# Altium schematic sheet Robo.SchDoc
size A; SheetNumber: 1; SheetTotal: 2
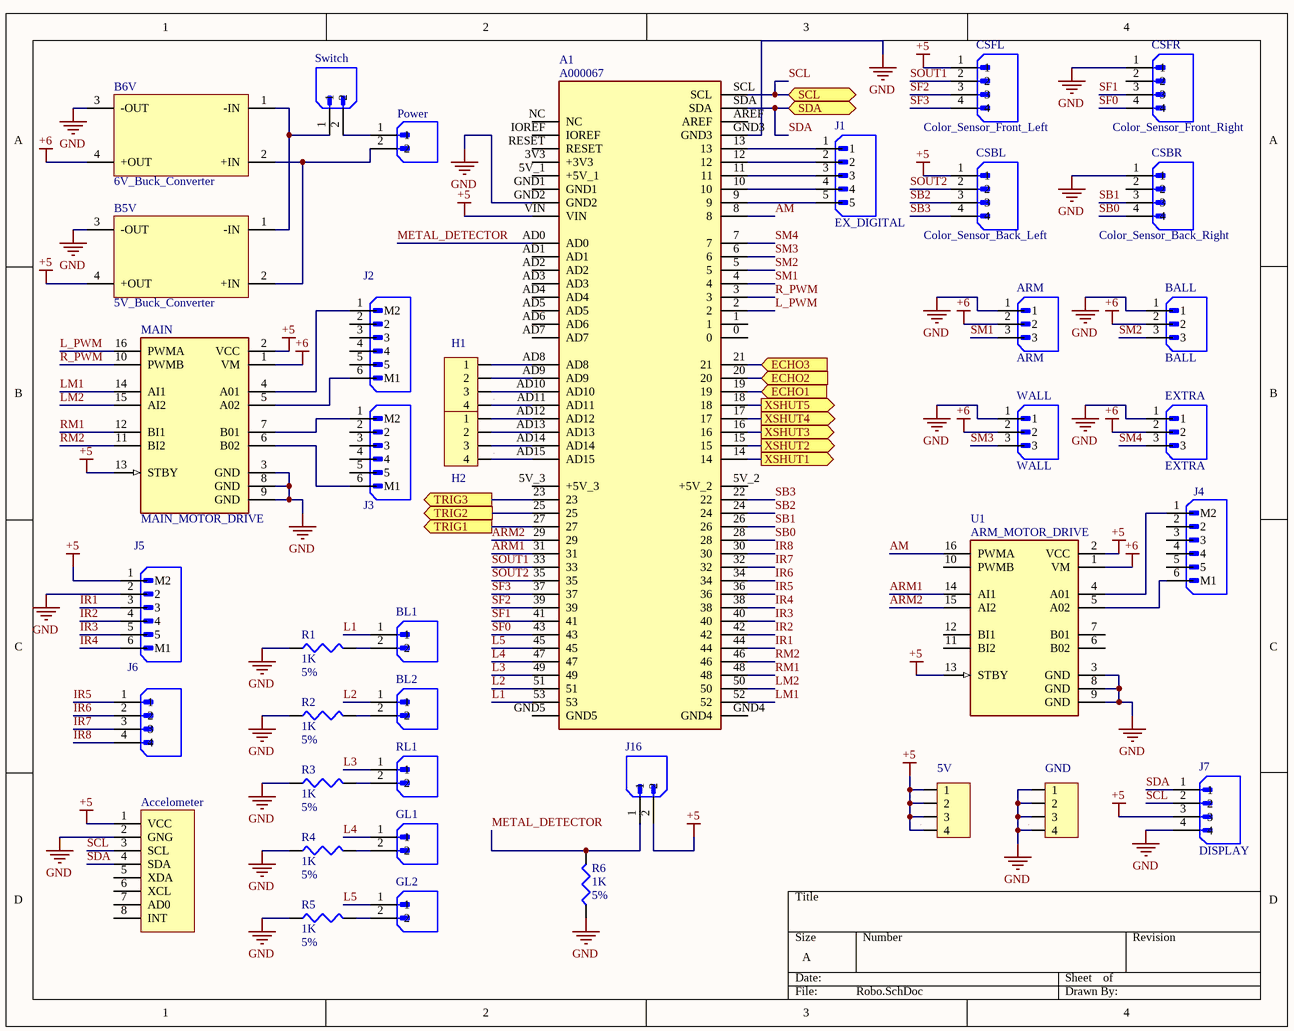
[diagram p0: Robo.SchDoc]

## Parts
5V  61300411121  [61300411121 - duplicate - duplicate]  (value not drawn)
A1  A000067  [ARDUINO_A000067]
Accelometer  Accelometer  [8pin_header]  (value not drawn)
ARM  ARM  [JST_B3B-XH-A (LF)(SN)]
B5V  5V_Buck_Converter  [Buck_Conveter]
B6V  6V_Buck_Converter  [Buck_Conveter]
BALL  BALL  [JST_B3B-XH-A (LF)(SN)]
BL1  B2B-XH-A(LF)(SN)  [JST_B2B-XH-A(LF)(SN)]  (value not drawn)
BL2  B2B-XH-A(LF)(SN)  [JST_B2B-XH-A(LF)(SN)]  (value not drawn)
CSBL  Color_Sensor_Back_Left  [JST_B4B-XH-A(LF)(SN)]
CSBR  Color_Sensor_Back_Right  [JST_B4B-XH-A(LF)(SN)]
CSFL  Color_Sensor_Front_Left  [JST_B4B-XH-A(LF)(SN)]
CSFR  Color_Sensor_Front_Right  [JST_B4B-XH-A(LF)(SN)]
EXTRA  EXTRA  [JST_B3B-XH-A (LF)(SN)]
GL1  B2B-XH-A(LF)(SN)  [JST_B2B-XH-A(LF)(SN)]  (value not drawn)
GL2  B2B-XH-A(LF)(SN)  [JST_B2B-XH-A(LF)(SN)]  (value not drawn)
GND  61300411121  [61300411121 - duplicate - duplicate]  (value not drawn)
H1  61300411121  [61300411121 - duplicate - duplicate]  (value not drawn)
H2  61300411121  [61300411121 - duplicate - duplicate]  (value not drawn)
J1  EX_DIGITAL  [JST_B5B-XH-A(LF)(SN)]
J2  B6B-XH-A(LF)(SN)  [JST_B6B-XH-A(LF)(SN)]  (value not drawn)
J3  B6B-XH-A(LF)(SN)  [JST_B6B-XH-A(LF)(SN)]  (value not drawn)
J4  B6B-XH-A(LF)(SN)  [JST_B6B-XH-A(LF)(SN)]  (value not drawn)
J5  B6B-XH-A(LF)(SN)  [JST_B6B-XH-A(LF)(SN)]  (value not drawn)
J6  B4B-XH-A(LF)(SN)  [JST_B4B-XH-A(LF)(SN)]  (value not drawn)
J7  DISPLAY  [JST_B4B-XH-A(LF)(SN)]
J16  B2B-XH-A(LF)(SN)  [JST_B2B-XH-A(LF)(SN)]  (value not drawn)
MAIN  MAIN_MOTOR_DRIVE  [MODULE_ROB-14450]
Power  B2B-XH-A(LF)(SN)  [JST_B2B-XH-A(LF)(SN)]  (value not drawn)
R1  Resistance: 1K  Tolerance: 5%  [Resister]  (hidden comment: CFM12JT1K00)
R2  Resistance: 1K  Tolerance: 5%  [Resister]  (hidden comment: CFM12JT1K00)
R3  Resistance: 1K  Tolerance: 5%  [Resister]  (hidden comment: CFM12JT1K00)
R4  Resistance: 1K  Tolerance: 5%  [Resister]  (hidden comment: CFM12JT1K00)
R5  Resistance: 1K  Tolerance: 5%  [Resister]  (hidden comment: CFM12JT1K00)
R6  Resistance: 1K  Tolerance: 5%  [Resister]  (hidden comment: CFM12JT1K00)
RL1  B2B-XH-A(LF)(SN)  [JST_B2B-XH-A(LF)(SN)]  (value not drawn)
Switch  B2B-XH-A(LF)(SN)  [JST_B2B-XH-A(LF)(SN)]  (value not drawn)
U1  ARM_MOTOR_DRIVE  [MODULE_ROB-14450]
WALL  WALL  [JST_B3B-XH-A (LF)(SN)]

## Ports
ECHO1 (in, see Robo2[3A]), ECHO2 (in, see Robo2[3A]), ECHO3 (in, see Robo2[1B]), SCL (bidir, see Robo2[1A], Robo2[1B], Robo2[2A], Robo2[2B], Robo2[3B]), SDA (bidir, see Robo2[1A], Robo2[1B], Robo2[2A], Robo2[2B], Robo2[3B]), TRIG1 (out, see Robo2[3A]), TRIG2 (out, see Robo2[3A]), TRIG3 (out, see Robo2[1A]), XSHUT1 (out, see Robo2[1A]), XSHUT2 (out, see Robo2[2A]), XSHUT3 (out, see Robo2[2B]), XSHUT4 (out, see Robo2[2B]), XSHUT5 (out, see Robo2[1B])

## Nets
+5: 5V.1 5V.2 5V.3 5V.4 A1.VIN Accelometer.1(VCC) B5V.4(+OUT) CSBL.1 CSFL.1 J5.1(M2) J7.3 J16.2 MAIN.2(VCC) MAIN.13(STBY) U1.2(VCC) U1.13(STBY)
+6: ARM.2 B6V.4(+OUT) BALL.2 EXTRA.2 MAIN.1(VM) U1.1(VM) WALL.2
GND: A1.GND2 A1.GND3 Accelometer.2(GNG) ARM.1 B5V.3(-OUT) B6V.3(-OUT) BALL.1 CSBR.1 CSFR.1 EXTRA.1 GND.1 GND.2 GND.3 GND.4 J5.2 J7.4 MAIN.3(GND) MAIN.8(GND) MAIN.9(GND) R1.1 R2.1 R3.1 R4.1 R5.1 R6.1 U1.3(GND) U1.8(GND) U1.9(GND) WALL.1
AM: A1.8 U1.16(PWMA)
ARM1: A1.31 U1.14(AI1)
ARM2: A1.29 U1.15(AI2)
ECHO1: A1.19 ; port ECHO1
ECHO2: A1.20 ; port ECHO2
ECHO3: A1.21 ; port ECHO3
IR1: A1.44 J5.3
IR2: A1.42 J5.4
IR3: A1.40 J5.5
IR4: A1.38 J5.6(M1)
IR5: A1.36 J6.1
IR6: A1.34 J6.2
IR7: A1.32 J6.3
IR8: A1.30 J6.4
L1: A1.53 BL1.1
L2: A1.51 BL2.1
L3: A1.49 RL1.1
L4: A1.47 GL1.1
L5: A1.45 GL2.1
L_PWM: A1.2 MAIN.16(PWMA)
LM1: A1.52 MAIN.14(AI1)
LM2: A1.50 MAIN.15(AI2)
METAL_DETECTOR: A1.AD0 J16.1 R6.2
R_PWM: A1.3 MAIN.10(PWMB)
RM1: A1.48 MAIN.12(BI1)
RM2: A1.46 MAIN.11(BI2)
SB0: A1.28 CSBR.4
SB1: A1.26 CSBR.3
SB2: A1.24 CSBL.3
SB3: A1.22 CSBL.4
SCL: A1.SCL Accelometer.3(SCL) J7.2 ; port SCL
SDA: A1.SDA Accelometer.4(SDA) J7.1 ; port SDA
SF0: A1.43 CSFR.4
SF1: A1.41 CSFR.3
SF2: A1.39 CSFL.3
SF3: A1.37 CSFL.4
SM1: A1.4 ARM.3
SM2: A1.5 BALL.3
SM3: A1.6 WALL.3
SM4: A1.7 EXTRA.3
SOUT1: A1.33 CSFL.2
SOUT2: A1.35 CSBL.2
TRIG1: A1.27 ; port TRIG1
TRIG2: A1.25 ; port TRIG2
TRIG3: A1.23 ; port TRIG3
XSHUT1: A1.14 ; port XSHUT1
XSHUT2: A1.15 ; port XSHUT2
XSHUT3: A1.16 ; port XSHUT3
XSHUT4: A1.17 ; port XSHUT4
XSHUT5: A1.18 ; port XSHUT5
NetA1_9: A1.9 J1.5
NetA1_10: A1.10 J1.4
NetA1_11: A1.11 J1.3
NetA1_12: A1.12 J1.2
NetA1_13: A1.13 J1.1
NetA1_AD8: A1.AD8 H1.1
NetA1_AD9: A1.AD9 H1.2
NetA1_AD10: A1.AD10 H1.3
NetA1_AD11: A1.AD11 H1.4
NetA1_AD12: A1.AD12 H2.1
NetA1_AD13: A1.AD13 H2.2
NetA1_AD14: A1.AD14 H2.3
NetA1_AD15: A1.AD15 H2.4
NetB5V_1: B5V.1(-IN) B6V.1(-IN) Switch.1
NetB5V_2: B5V.2(+IN) B6V.2(+IN) Power.2
NetBL1_2: BL1.2 R1.2
NetBL2_2: BL2.2 R2.2
NetGL1_2: GL1.2 R4.2
NetGL2_2: GL2.2 R5.2
NetJ2_1: J2.1(M2) MAIN.4(A01)
NetJ2_6: J2.6(M1) MAIN.5(A02)
NetJ3_1: J3.1(M2) MAIN.7(B01)
NetJ3_6: J3.6(M1) MAIN.6(B02)
NetJ4_1: J4.1(M2) U1.4(A01)
NetJ4_6: J4.6(M1) U1.5(A02)
NetPower_1: Power.1 Switch.2
NetR3_2: R3.2 RL1.2

Not connected (* = marked no-connect by the designer): A1 0 1 3V3(+3V3) 5V_1(+5V_1) 5V_2(+5V_2) 5V_3(+5V_3) AD1 AD2 AD3 AD4 AD5 AD6 AD7 AREF GND1 GND4 GND5 IOREF NC RESET; Accelometer 5(XDA) 6(XCL) 7(AD0) 8(INT); CSBR 2; CSFR 2; J2 2 3 4 5; J3 2 3 4 5; J4 2 3 4 5; U1 6(B02) 7(B01) 10(PWMB) 11(BI2) 12(BI1)

## Library data of the parts
5V GND H1 H2 = 61300411121: Board Connector, 4 Contact(s), 1 Row(s), Male, Straight, 0.1 inch Pitch, Solder Terminal, Locking, Black Insulator, Plug; Manufacturer: Wurth Electronics; Contact Pattern: RECTANGULAR; Contact Resistance: 20mR; Contact Style: SQ PIN-SKT; Dielectric Withstanding Voltage (AC): 500V; Insulation Resistance: 1GR; Number Of Connectors: 1; Rated Current (Signal): 3A; Number of Contacts: 4; Body Length: 0.4inch; Reference Standard: UL; Reliability: COMMERCIAL; Supplier: Digi-Key; Supplier Part Number: 732-5317-ND; Manufacturer Part Number: 61300411121; RoHS: Yes; Category: Headers and Wire Housings; Stock: 103058; Pricing: 1=0.19, 10=0.163, 25=0.1352, 50=0.113, 100=0.102, 1000=0.094 (USD); Mounting Technology: Board; Contact Material: Copper Alloy; Contact Finish - Mating: GOLD; Contact Finish - Termination: Gold (Au) - with Nickel (Ni) barrier; Insulation Color: Black; Insulation Material: Polybutylene; Min Operating Temperature: -40°C; Max Operating Temperature: 125°C; Connector Type: BOARD CONNECTOR; JESD-609 Code: e4; Body/Shell Style: PLUG; Contact Gender: Male; Mounting Style: STRAIGHT; Number of Rows Loaded: 1; PCB Contact Pattern: RECTANGULAR; Termination: Solder; Body Breadth: 0.1inch; Body Depth: 0.1inch; Mating Contact Pitch: 0.1inch; Mounting Option 1: LOCKING; Terminal Length: 0.118inch; Terminal Pitch: 2.54mm; Reach SVHC Compliant: Yes; RoHS Compliant: Yes; ComponentLink1URL: https://datasheet.ciiva.com:443/pdfs/VipMasterIC/IC/MIDC/MIDCS07676/MIDCS07676-1.pdf?src-supplier=IHS+Markit; ComponentLink1Description: https://datasheet.ciiva.com:443/pdfs/VipMasterIC/IC/MIDC/MIDCS07676/MIDCS07676-1.pdf?src-supplier=IHS+Markit; ComponentLink2URL: http://www.farnell.com/cad/1737268.pdf?src-supplier=Element14; ComponentLink2Description: http://www.farnell.com/cad/1737268.pdf?src-supplier=Element14; ComponentLink3URL: https://katalog.we-online.de/em/datasheet/6130xx11121.pdf?src-supplier=Digi-Key; ComponentLink3Description: https://katalog.we-online.de/em/datasheet/6130xx11121.pdf?src-supplier=Digi-Key
A1 = A000067: Arduino Mega 2560 Rev3. ATmega2560 Microcontroller Mega Development Board 16MHz CPU 8KB RAM 4KB/256KB EEPROM/Flash; MF: Arduino; Package: Non-Standard Arduino; Price: None; Check_prices: https://www.snapeda.com/parts/A000067/Arduino/view-part/?ref=eda; Value: *; SnapEDA_Link: https://www.snapeda.com/parts/A000067/Arduino/view-part/?ref=snap; MP: A000067; Availability: In Stock; Purchase-URL: https://pricing.snapeda.com/search?q=A000067&ref=eda
Accelometer = 8pin_headers
ARM BALL EXTRA WALL = B3B-XH-A_(LF)(SN): Connector Header Through Hole 3 position 0.098 (2.50mm); MF: JST Sales America Inc.; MP: B3B-XH-A (LF)(SN); SnapEDA_Link: https://www.snapeda.com/parts/B3B-XH-A%20(LF)(SN)/JST+Sales+America+Inc./view-part/?ref=snap; Package: None; Value: *; Check_prices: https://www.snapeda.com/parts/B3B-XH-A%20(LF)(SN)/JST+Sales+America+Inc./view-part/?ref=eda
B5V B6V = Buck_Converter
BL1 BL2 GL1 GL2 J16 Power RL1 Switch = B2B-XH-A(LF)(SN): Connector Header Through Hole 2 position 0.098 (2.50mm); MF: JST Sales America Inc.; SnapEDA_Link: https://www.snapeda.com/parts/B2B-XH-A(LF)(SN)/JST+Sales+America+Inc./view-part/?ref=snap; Package: None; Value: *; MP: B2B-XH-A(LF)(SN); Check_prices: https://www.snapeda.com/parts/B2B-XH-A(LF)(SN)/JST+Sales+America+Inc./view-part/?ref=eda
CSBL CSBR CSFL CSFR J6 J7 = B4B-XH-A(LF)(SN): Connector Header Through Hole 4 position 0.098 (2.50mm); MF: JST Sales; SnapEDA_Link: https://www.snapeda.com/parts/B4B-XH-A(LF)(SN)/JST+Sales+America+Inc./view-part/?ref=snap; Package: None; MP: B4B-XH-A(LF)(SN); Check_prices: https://www.snapeda.com/parts/B4B-XH-A(LF)(SN)/JST+Sales+America+Inc./view-part/?ref=eda; Purchase-URL: https://pricing.snapeda.com/search/part/B4B-XH-A(LF)(SN)/?ref=eda; Price: None; Value: *; Availability: In Stock
J1 = B5B-XH-A(LF)(SN): Connector Header Through Hole 5 position 0.098 (2.50mm); MF: JST Sales America Inc.; SnapEDA_Link: https://www.snapeda.com/parts/B5B-XH-A(LF)(SN)/JST+Sales+America+Inc./view-part/?ref=snap; Package: None; Value: *; MP: B5B-XH-A(LF)(SN); Check_prices: https://www.snapeda.com/parts/B5B-XH-A(LF)(SN)/JST+Sales+America+Inc./view-part/?ref=eda
J2-J5 = B6B-XH-A(LF)(SN): Connector Header Through Hole 6 position 0.098 (2.50mm); MF: JST Sales; SnapEDA_Link: https://www.snapeda.com/parts/B6B-XH-A(LF)(SN)/JST+Sales+America+Inc./view-part/?ref=snap; Package: None; Value: *; MP: B6B-XH-A(LF)(SN); Check_prices: https://www.snapeda.com/parts/B6B-XH-A(LF)(SN)/JST+Sales+America+Inc./view-part/?ref=eda
MAIN U1 = ROB-14450: TB6612FNG Motor Controller/Driver Power Management Evaluation Board; MF: SparkFun Electronics; Check_prices: https://www.snapeda.com/parts/ROB-14450/SparkFun%20Electronics/view-part/2656367/?ref=eda; Package: None; MP: ROB-14450; Value: *; Availability: In Stock; SnapEDA_Link: https://www.snapeda.com/parts/ROB-14450/SparkFun%20Electronics/view-part/2656367/?ref=snap; Price: None
R1-R6 = CFM12JT1K00: Fixed Resistor, Carbon Film, 0.5W, 1000ohm, 350V, 5% +/-Tol, -400,0ppm/Cel, Through Hole Mount; Manufacturer: Stackpole Electronics; Power: 500mW; Rated Temperature: 70°C; Value: 1kR; Temperature Coefficient: 400ppm/°C; Lead Diameter: 0.55mm; Lead Length: 28mm; Package Diameter: 2.3mm; Package Length: 6mm; Supplier: Digi-Key; Supplier Part Number: S1KHCT-ND; Manufacturer Part Number: CFM12JT1K00; RoHS: Yes; Category: Through-Hole Resistors; Stock: 145304; Pricing: 1=0.1, 10=0.067, 25=0.0488, 50=0.0372, 100=0.0274, 250=0.02092, 500=0.01672, 1000=0.01231 (USD); Mounting Technology: Through Hole; Pins: 2; Package Shape: Tubular; Terminal Finish: Tin; Min Operating Temperature: -55°C; Max Operating Temperature: 155°C; Resistor Type: FIXED RESISTOR; Construction: Tubular; Package Style: AxialMeter; Packaging: Tape and Reel; Technology: CARBON FILM; Termination: Wire; Working Voltage: 350V; JESD-609 Code: e3; Reach SVHC Compliant: Yes; RoHS Compliant: Yes; ComponentLink1URL: https://datasheet.ciiva.com:443/pdfs/VipMasterIC/IC/SEIE/SEIE-S-A0009883960/SEIE-S-A0009883960-1.pdf?src-supplier=IHS+Markit; ComponentLink1Description: https://datasheet.ciiva.com:443/pdfs/VipMasterIC/IC/SEIE/SEIE-S-A0009883960/SEIE-S-A0009883960-1.pdf?src-supplier=IHS+Markit; ComponentLink2URL: http://components.arrow.com/part/dataview/51859118S46073N1174?src-supplier=Arrow+Electronics; ComponentLink2Description: http://components.arrow.com/part/dataview/51859118S46073N1174?src-supplier=Arrow+Electronics; ComponentLink3URL: https://www.seielect.com/Catalog/SEI-CF_CFM.pdf?src-supplier=Digi-Key; ComponentLink3Description: https://www.seielect.com/Catalog/SEI-CF_CFM.pdf?src-supplier=Digi-Key; ComponentLink4URL: https://www.seielect.com/catalog/SEI-Packaging.pdf?src-supplier=Digi-Key; ComponentLink4Description: https://www.seielect.com/catalog/SEI-Packaging.pdf?src-supplier=Digi-Key; ComponentLink5URL: https://www.seielect.com/catalog/SEI-CF_CFM.pdf?src-supplier=Avnet; ComponentLink5Description: https://www.seielect.com/catalog/SEI-CF_CFM.pdf?src-supplier=Avnet; ComponentLink6URL: https://www.verical.com/server-webapp/html/getDatasheet?partID=470997&src-supplier=Verical; ComponentLink6Description: https://www.verical.com/server-webapp/html/getDatasheet?partID=470997&src-supplier=Verical